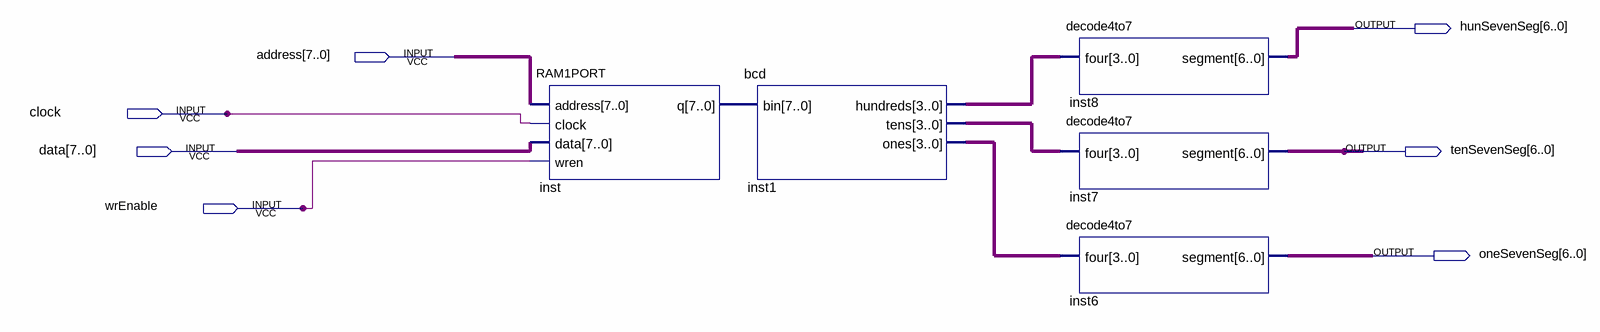
[diagram p0: schematic sheet]
// Quartus schematic SRAM.bdf as structural Verilog: 5 symbols, 7 pins
module SRAM (
  input  [7:0] address,
  input  clock,
  input  [7:0] data,
  input  wrEnable,
  output [6:0] hunSevenSeg,
  output [6:0] tenSevenSeg,
  output [6:0] oneSevenSeg
);

  wire [3:0] inst1_hundreds, inst1_ones, inst1_tens;
  wire [7:0] inst_q;

  RAM1PORT inst (.address(address), .clock(clock), .data(data), .wren(wrEnable), .q(inst_q));
  bcd inst1 (.bin(inst_q), .hundreds(inst1_hundreds), .tens(inst1_tens), .ones(inst1_ones));
  decode4to7 inst8 (.four(inst1_hundreds), .segment(hunSevenSeg));
  decode4to7 inst7 (.four(inst1_tens), .segment(tenSevenSeg));
  decode4to7 inst6 (.four(inst1_ones), .segment(oneSevenSeg));
endmodule
